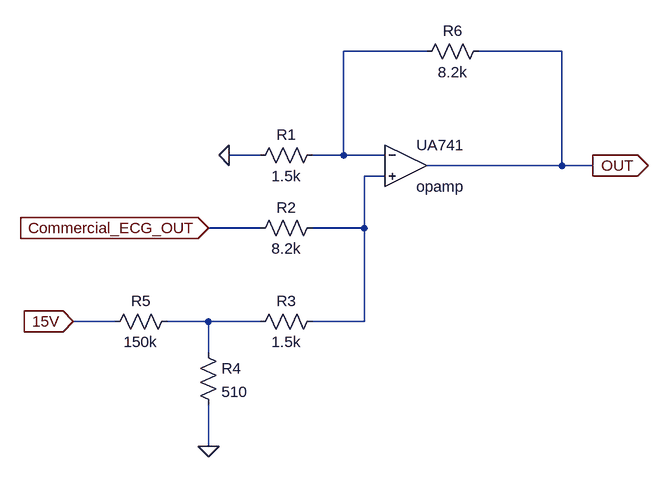
[diagram p0: schematic amp_level_shift.asc]
amp_level_shift.asc, the LTspice schematic file:
Version 4
SHEET 1 880 680
WIRE 192 -16 64 -16
WIRE 400 -16 272 -16
WIRE -64 144 -112 144
WIRE 64 144 64 -16
WIRE 64 144 16 144
WIRE 128 144 64 144
WIRE 400 160 400 -16
WIRE 400 160 192 160
WIRE 448 160 400 160
WIRE 128 176 96 176
WIRE -64 256 -144 256
WIRE 96 256 96 176
WIRE 96 256 16 256
WIRE -288 400 -352 400
WIRE -144 400 -208 400
WIRE -64 400 -144 400
WIRE 96 400 96 256
WIRE 96 400 16 400
WIRE -144 448 -144 400
WIRE -144 592 -144 528
FLAG -144 256 Commercial_ECG_OUT
IOPIN -144 256 In
FLAG -112 144 0
FLAG -144 592 0
FLAG -352 400 15V
IOPIN -352 400 In
FLAG 448 160 OUT
IOPIN 448 160 Out
SYMBOL OpAmps\\opamp 160 96 R0
SYMATTR InstName UA741
SYMBOL res 32 128 R90
WINDOW 0 0 56 VBottom 2
WINDOW 3 32 56 VTop 2
SYMATTR InstName R1
SYMATTR Value 1.5k
SYMBOL res 32 240 R90
WINDOW 0 0 56 VBottom 2
WINDOW 3 32 56 VTop 2
SYMATTR InstName R2
SYMATTR Value 8.2k
SYMBOL res 32 384 R90
WINDOW 0 0 56 VBottom 2
WINDOW 3 32 56 VTop 2
SYMATTR InstName R3
SYMATTR Value 1.5k
SYMBOL res -160 432 R0
SYMATTR InstName R4
SYMATTR Value 510
SYMBOL res -192 384 R90
WINDOW 0 0 56 VBottom 2
WINDOW 3 32 56 VTop 2
SYMATTR InstName R5
SYMATTR Value 150k
SYMBOL res 288 -32 R90
WINDOW 0 0 56 VBottom 2
WINDOW 3 32 56 VTop 2
SYMATTR InstName R6
SYMATTR Value 8.2k

The netlist it stands for:
* amp_level_shift.asc
XUA741 N001 N002 OUT opamp Aol=100K GBW=10Meg  ; pins invin noninvin out
R1 N001 0 1.5k
R2 N002 Commercial_ECG_OUT 8.2k
R3 N002 N003 1.5k
R4 N003 0 510
R5 N003 15V 150k
R6 OUT N001 8.2k
.backanno
.end